# EAGLE design main (EAGLE 5.11)
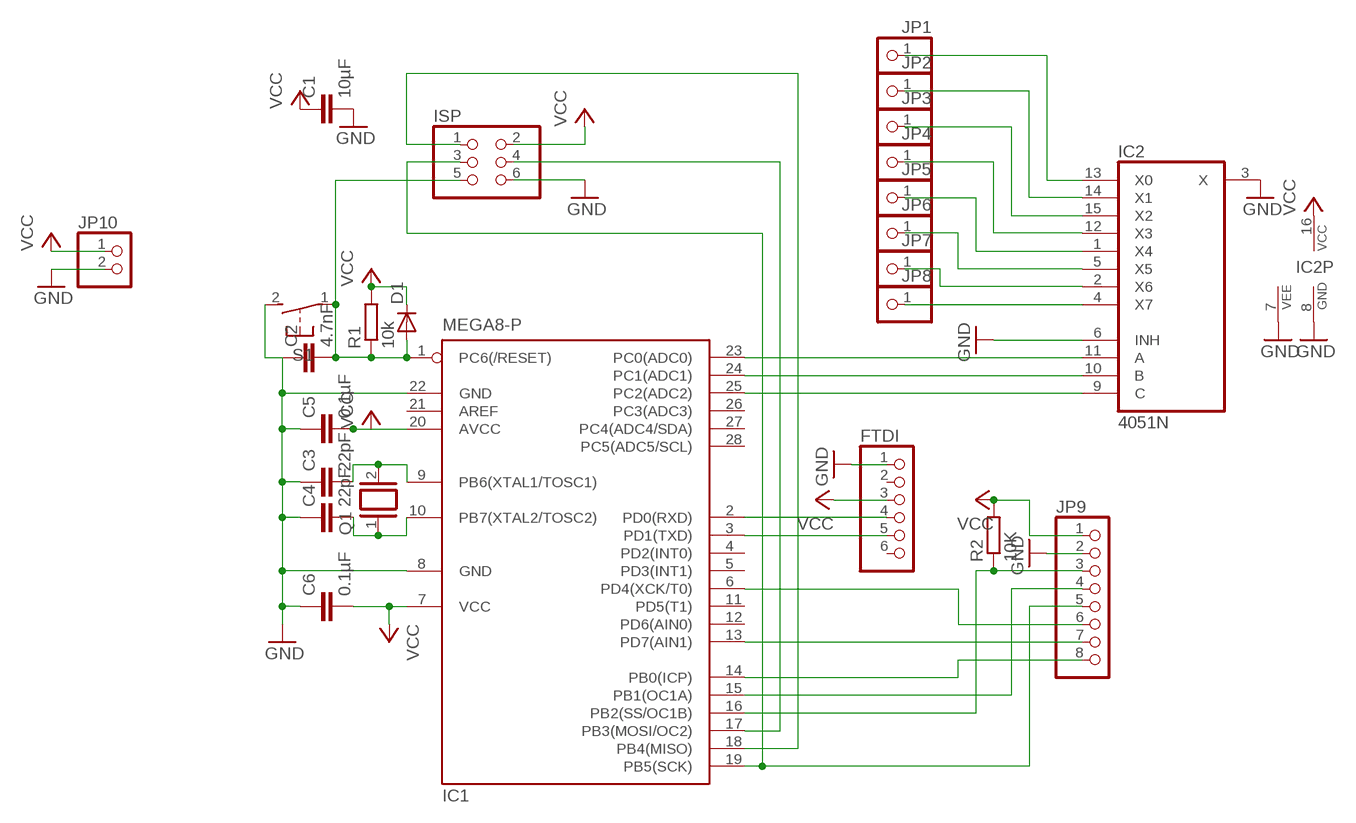
[diagram p0: schematic, sheet 1]

## Parts
C1  10µF  C-EU025-025X050  [C025-025X050]
C2  4.7nF  C-EU025-025X050  [C025-025X050]
C3  22pF  C-EU025-025X050  [C025-025X050]
C4  22pF  C-EU025-025X050  [C025-025X050]
C5  0.1µF  C-EU025-025X050  [C025-025X050]
C6  0.1µF  C-EU025-025X050  [C025-025X050]
D1  DIODE-D-2.5  [D-2.5]
FTDI  PINHD-1X6  [1X06]
IC1  MEGA8-P  [DIL28-3]
IC2  4051N  [DIL16]
ISP  PINHD-2X3  [2X03]
JP1  PINHD-1X1  [1X01]
JP2  PINHD-1X1  [1X01]
JP3  PINHD-1X1  [1X01]
JP4  PINHD-1X1  [1X01]
JP5  PINHD-1X1  [1X01]
JP6  PINHD-1X1  [1X01]
JP7  PINHD-1X1  [1X01]
JP8  PINHD-1X1  [1X01]
JP9  PINHD-1X8  [1X08]
JP10  PINHD-1X2  [1X02]
Q1  XTAL/S  [QS]
R1  10k  R-EU_0207/2V  [0207/2V]
R2  10K  R-EU_0207/5V  [0207/5V]
S1  DTS-3  [DTS-3]

## Nets
GND: C1.2 C2.1 C3.1 C4.1 C5.1 C6.1 FTDI.1 IC1.8(GND) IC1.22(GND) IC2.3(X) IC2.6(INH) IC2.7(VEE) IC2.8(GND) ISP.6 JP9.2 JP10.2 S1.2
N$1: IC2.13(X0) JP1.1
N$2: IC2.14(X1) JP2.1
N$3: IC2.15(X2) JP3.1
N$4: IC2.12(X3) JP4.1
N$5: IC2.1(X4) JP5.1
N$6: IC2.5(X5) JP6.1
N$7: IC2.2(X6) JP7.1
N$8: IC2.4(X7) JP8.1
N$9: IC1.25(PC2(ADC2)) IC2.9(C)
N$10: IC1.24(PC1(ADC1)) IC2.10(B)
N$11: IC1.23(PC0(ADC0)) IC2.11(A)
N$12: C2.2 D1.A IC1.1(PC6(/RESET)) ISP.5 R1.1 S1.1
N$13: C3.2 IC1.9(PB6(XTAL1/TOSC1)) Q1.2
N$14: C4.2 IC1.10(PB7(XTAL2/TOSC2)) Q1.1
N$15: IC1.16(PB2(SS/OC1B)) JP9.3 R2.1
N$16: IC1.15(PB1(OC1A)) JP9.4
N$17: FTDI.4 IC1.2(PD0(RXD))
N$18: IC1.6(PD4(XCK/T0)) JP9.6
N$19: IC1.13(PD7(AIN1)) JP9.7
N$20: IC1.14(PB0(ICP)) JP9.8
N$21: IC1.18(PB4(MISO)) ISP.1
N$22: IC1.17(PB3(MOSI/OC2)) ISP.4
N$23: IC1.19(PB5(SCK)) ISP.3 JP9.5
N$24: FTDI.5 IC1.3(PD1(TXD))
VCC: C1.1 C5.2 C6.2 D1.C FTDI.3 IC1.7(VCC) IC1.20(AVCC) IC2.16(VCC) ISP.2 JP9.1 JP10.1 R1.2 R2.2
Unconnected: FTDI.2 FTDI.6 IC1.4(PD2(INT0)) IC1.5(PD3(INT1)) IC1.11(PD5(T1)) IC1.12(PD6(AIN0)) IC1.21(AREF) IC1.26(PC3(ADC3)) IC1.27(PC4(ADC4/SDA)) IC1.28(PC5(ADC5/SCL))

## Library data of the parts
C1-C6 = rcl:C-EU: CAPACITOR, European symbol
D1 = diode:DIODE-: DIODE
FTDI = pinhead:PINHD-1X6: PIN HEADER
IC1 = atmel:MEGA8-P: MICROCONTROLLER 8 Kbytes FLASH, 1 kbytes SRAM, 512 bytes EEPROM, USART, 4-channel 10 bit ADC, 2-channel 8 bit ADC Pin compatible with Atmega48, ATMega88, ATMega168 Source: avr.lbr; OC_FARNELL: unknown; OC_NEWARK: unknown
IC2 = 40xx:4051: 8-channel ANALOG MULTIPLEXER
ISP = pinhead:PINHD-2X3: PIN HEADER
JP1-JP8 = pinhead:PINHD-1X1: PIN HEADER
JP9 = pinhead:PINHD-1X8: PIN HEADER
JP10 = pinhead:PINHD-1X2: PIN HEADER
Q1 = special:XTAL/S: CRYSTAL
R1 R2 = rcl:R-EU_: RESISTOR, European symbol
S1 = switch-tact:DTS-3

## Board
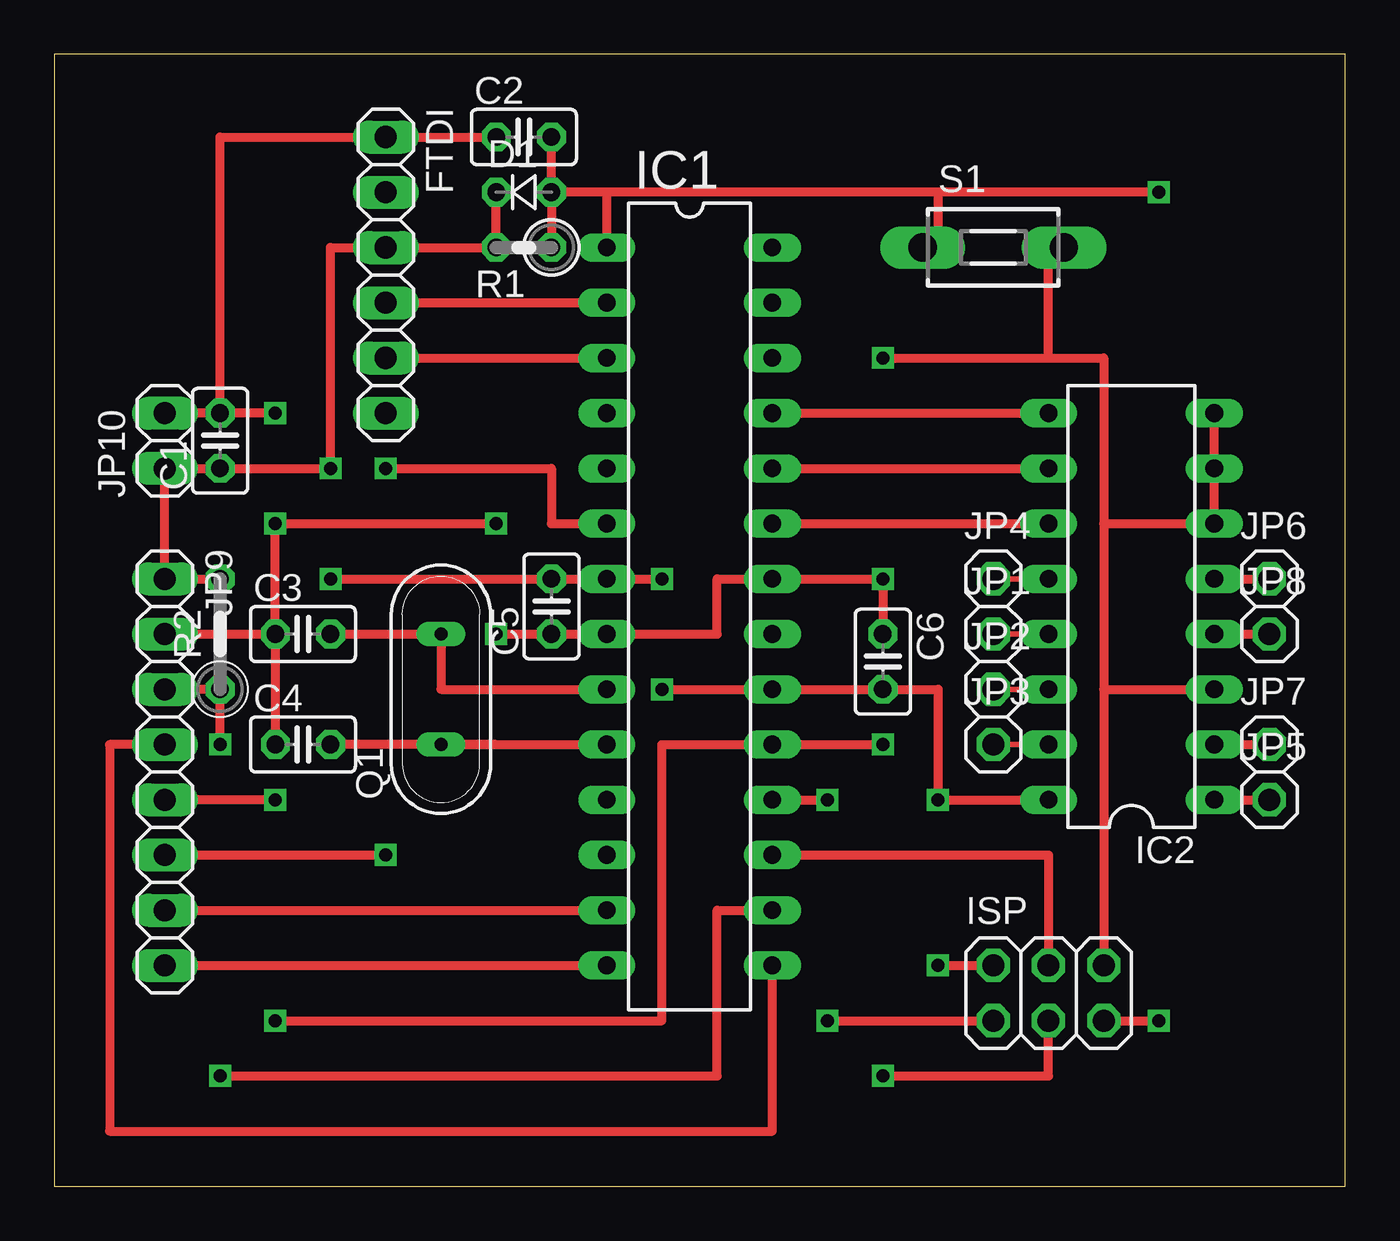
[diagram p1: board, top side]
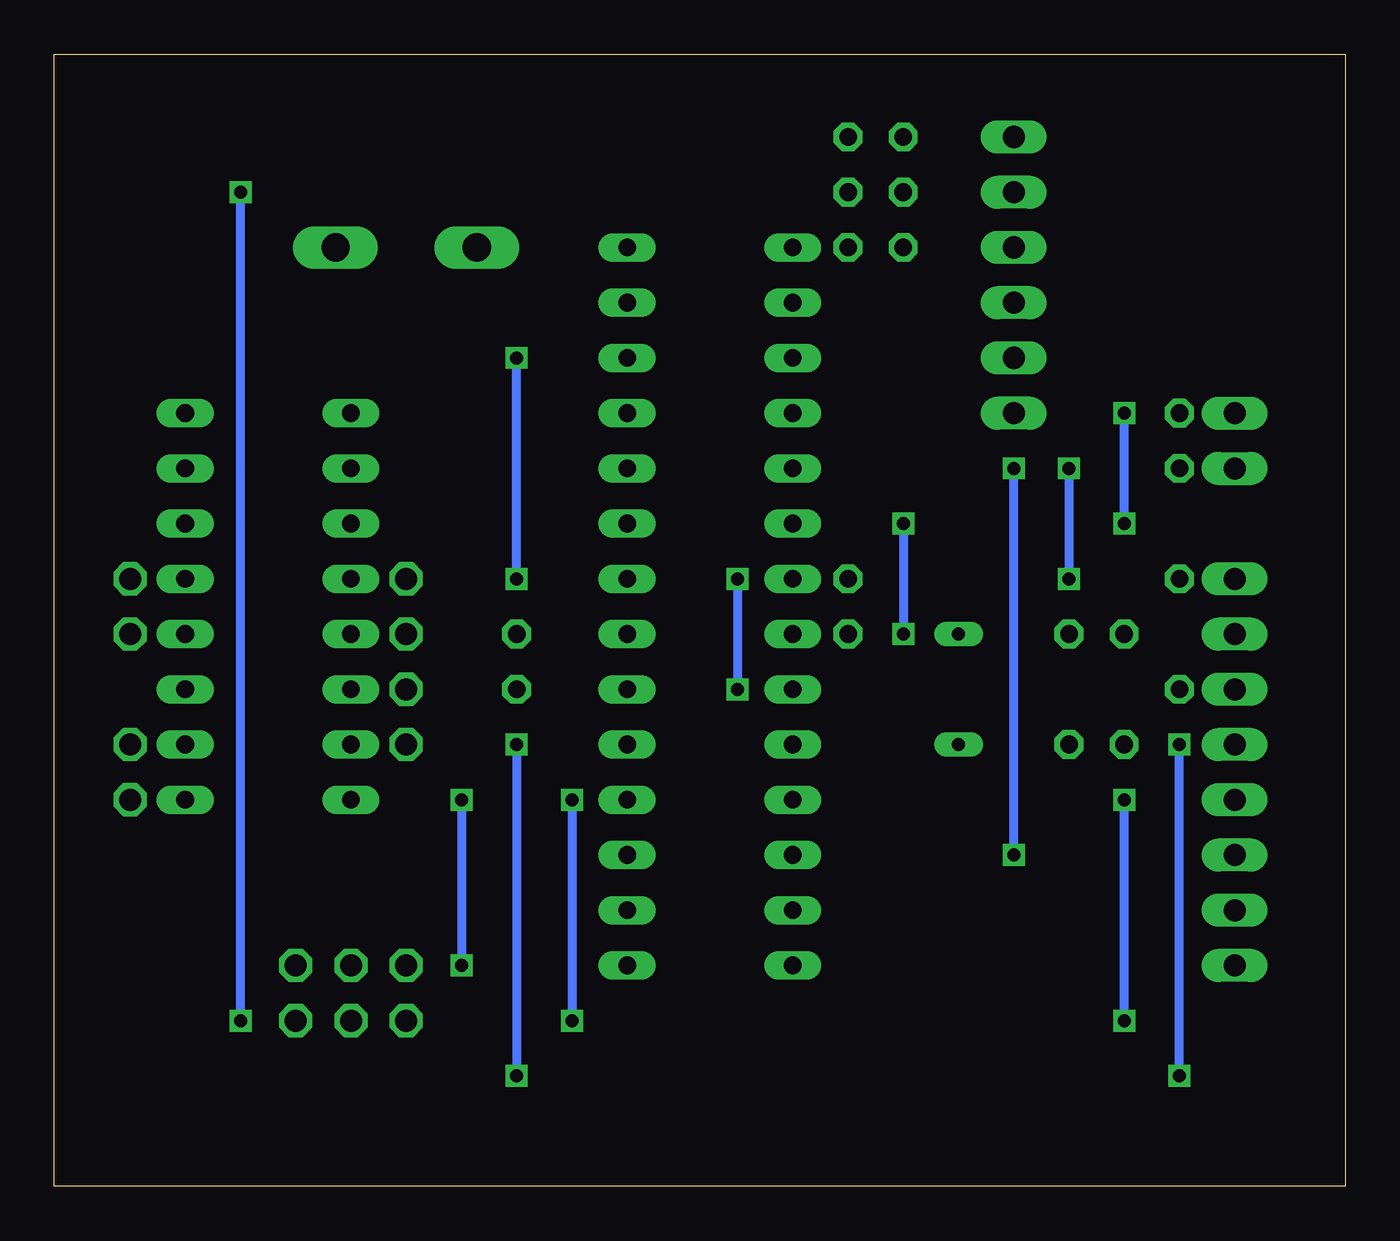
[diagram p2: board, bottom side, seen from below]

Size 59.36 x 52.06 mm. Coordinates in mm from the lower left corner, seen from the top.
Outline: 0,0 59.36,0 59.36,52.06 0,52.06 0,0
Copper layers (1*16): Top 0.035mm / dielectric 1.5mm / Bottom 0.035mm
Design rules "default *": minimum track width 10mil, minimum drill 14mil, track to track 8mil, track to pad 8mil, pad to pad 8mil, via to via 8mil, smd to smd 8mil, copper to edge 40mil, drill to drill 8mil, minimum pad ring 10mil, minimum via ring 8mil, stop-mask expansion 4mil, vias tented up to drill 0mil, thermal gap 10mil

### Footprints (pad centres in the part's own frame; a part is rotated, then mirrored left to right if it is on the bottom)
C025-025X050 = drill 0.813 octagon: 1 -1.27,0; 2 1.27,0
D-2.5 = drill 0.813 octagon: A 1.27,0; C -1.27,0
1X06 = drill 1.016 long: 1 -6.35,0; 2 -3.81,0; 3 -1.27,0; 4 1.27,0; 5 3.81,0; 6 6.35,0
DIL28-3 = drill 0.813 long: 1 -16.51,-3.81; 2 -13.97,-3.81; 3 -11.43,-3.81; 4 -8.89,-3.81; 5 -6.35,-3.81; 6 -3.81,-3.81; 7 -1.27,-3.81; 8 1.27,-3.81; 9 3.81,-3.81; 10 6.35,-3.81; 11 8.89,-3.81; 12 11.43,-3.81; 13 13.97,-3.81; 14 16.51,-3.81; 15 16.51,3.81; 16 13.97,3.81; 17 11.43,3.81; 18 8.89,3.81; 19 6.35,3.81; 20 3.81,3.81; 21 1.27,3.81; 22 -1.27,3.81; 23 -3.81,3.81; 24 -6.35,3.81; 25 -8.89,3.81; 26 -11.43,3.81; 27 -13.97,3.81; 28 -16.51,3.81
DIL16 = drill 0.813 long: 1 -8.89,-3.81; 2 -6.35,-3.81; 3 -3.81,-3.81; 4 -1.27,-3.81; 5 1.27,-3.81; 6 3.81,-3.81; 7 6.35,-3.81; 8 8.89,-3.81; 9 8.89,3.81; 10 6.35,3.81; 11 3.81,3.81; 12 1.27,3.81; 13 -1.27,3.81; 14 -3.81,3.81; 15 -6.35,3.81; 16 -8.89,3.81
2X03 = drill 1.016 octagon: 1 -2.54,-1.27; 2 -2.54,1.27; 3 0,-1.27; 4 0,1.27; 5 2.54,-1.27; 6 2.54,1.27
1X01 = drill 1.016 octagon: 1 0,0
1X08 = drill 1.016 long: 1 -8.89,0; 2 -6.35,0; 3 -3.81,0; 4 -1.27,0; 5 1.27,0; 6 3.81,0; 7 6.35,0; 8 8.89,0
1X02 = drill 1.016 long: 1 -1.27,0; 2 1.27,0
QS = drill 0.61 long: 1 -2.54,0; 2 2.54,0
0207/2V = drill 0.813 octagon: 1 -1.27,0; 2 1.27,0
0207/5V = drill 0.813 octagon: 1 -2.54,0; 2 2.54,0
DTS-3 = drill 1.3 long: 1 -3.25,0; 2 3.25,0

### Placement (x,y rotation side)
C1  7.62,34.29 90 top
C2  21.59,48.26 0 top
C3  11.43,25.4 0 top
C4  11.43,20.32 0 top
C5  22.86,26.67 90 top
C6  38.1,24.13 270 top
D1  21.59,45.72 0 top
FTDI  15.24,41.91 270 top
IC1  29.21,26.67 270 top
IC2  49.53,26.67 90 top
ISP  45.72,8.89 0 top
JP1  43.18,25.4 0 top
JP2  43.18,22.86 0 top
JP3  43.18,20.32 0 top
JP4  43.18,27.94 0 top
JP5  55.88,17.78 0 top
JP6  55.88,27.94 0 top
JP7  55.88,20.32 0 top
JP8  55.88,25.4 0 top
JP9  5.08,19.05 270 top
JP10  5.08,34.29 90 top
Q1  17.78,22.86 90 top
R1  21.59,43.18 180 top
R2  7.62,25.4 90 top
S1  43.18,43.18 0 top

### Tracks (layer width: path | path; a pad name or v marks a point on that pad's centre or on a via)
GND  (via drill 0.6)
  Top 0.406: IC2.8 IC2.7 IC2.6 48.26,30.48 | C1.2 JP10.2 | C6.1 v38.1,27.94 IC1.22 30.48,27.94 30.48,25.4 IC1.8 C5.1 v20.32,25.4 | JP9.2 C3.1 | C2.1 FTDI.1 7.62,48.26 C1.2 | 48.26,22.86 ISP.6 | 48.26,22.86 IC2.3 | 48.26,30.48 48.26,22.86 | 48.26,30.48 48.26,38.1 45.72,38.1 | v38.1,38.1 45.72,38.1 | v20.32,30.48 v10.16,30.48 C3.1 | v10.16,35.56 C1.2 | C3.1 C4.1 | S1.2 45.72,43.18 45.72,38.1
  Bottom 0.406: v38.1,27.94 v38.1,38.1 | v20.32,30.48 v20.32,25.4 | v10.16,30.48 v10.16,35.56
N$1
  Top 0.254: JP1.1 IC2.13
N$2
  Top 0.254: JP2.1 IC2.14
N$3
  Top 0.254: JP3.1 IC2.15
N$4
  Top 0.254: JP4.1 IC2.12
N$5
  Top 0.406: IC2.1 JP5.1
N$6
  Top 0.406: IC2.5 JP6.1
N$7
  Top 0.406: IC2.2 JP7.1
N$8
  Top 0.406: IC2.4 JP8.1
N$9
  Top 0.406: IC1.25 IC2.9
N$10
  Top 0.406: IC1.24 IC2.10
N$11
  Top 0.406: IC1.23 IC2.11
N$12  (via drill 0.6)
  Top 0.406: ISP.5 v50.8,7.62 | v50.8,45.72 40.64,45.72 | 40.64,45.72 25.4,45.72 | 25.4,45.72 IC1.1 | D1.A C2.2 | 25.4,45.72 D1.A | D1.A R1.1 | S1.1 40.64,43.18 40.64,45.72
  Bottom 0.406: v50.8,7.62 v50.8,45.72
N$13
  Top 0.406: C3.2 Q1.2 17.78,22.86 IC1.9
N$14
  Top 0.406: 20.32,20.32 IC1.10 | Q1.1 20.32,20.32 | 20.32,20.32 C4.2
N$15  (via drill 0.6)
  Top 0.406: IC1.16 30.48,12.7 30.48,5.08 v7.62,5.08 | JP9.3 R2.1 v7.62,20.32
  Bottom 0.406: v7.62,5.08 v7.62,20.32
N$16
  Top 0.406: JP9.4 2.54,20.32 2.54,2.54 33.02,2.54 IC1.15
N$17
  Top 0.406: FTDI.4 IC1.2
N$18  (via drill 0.6)
  Top 0.406: v15.24,33.02 22.86,33.02 22.86,30.48 IC1.6 | JP9.6 v15.24,15.24
  Bottom 0.406: v15.24,15.24 v15.24,33.02
N$19
  Top 0.406: JP9.7 IC1.13
N$20
  Top 0.406: JP9.8 IC1.14
N$21  (via drill 0.6)
  Top 0.406: IC1.18 v35.56,17.78 | v35.56,7.62 ISP.1
  Bottom 0.406: v35.56,17.78 v35.56,7.62
N$22
  Top 0.406: IC1.17 45.72,15.24 ISP.4
N$23  (via drill 0.6)
  Top 0.406: ISP.3 45.72,5.08 v38.1,5.08 | v38.1,20.32 IC1.19 27.94,20.32 27.94,7.62 v10.16,7.62 | v10.16,17.78 JP9.5
  Bottom 0.406: v10.16,7.62 v10.16,17.78 | v38.1,20.32 v38.1,5.08
N$24
  Top 0.406: FTDI.5 IC1.3
VCC  (via drill 0.6)
  Top 0.406: v27.94,27.94 IC1.7 C5.2 v12.7,27.94 | v27.94,22.86 IC1.20 C6.2 40.64,22.86 v40.64,17.78 IC2.16 | R2.2 JP9.1 JP10.1 C1.1 v12.7,33.02 12.7,43.18 FTDI.3 R1.2 D1.C | v40.64,10.16 ISP.2
  Bottom 0.406: v27.94,27.94 v27.94,22.86 | v12.7,33.02 v12.7,27.94 | v40.64,17.78 v40.64,10.16